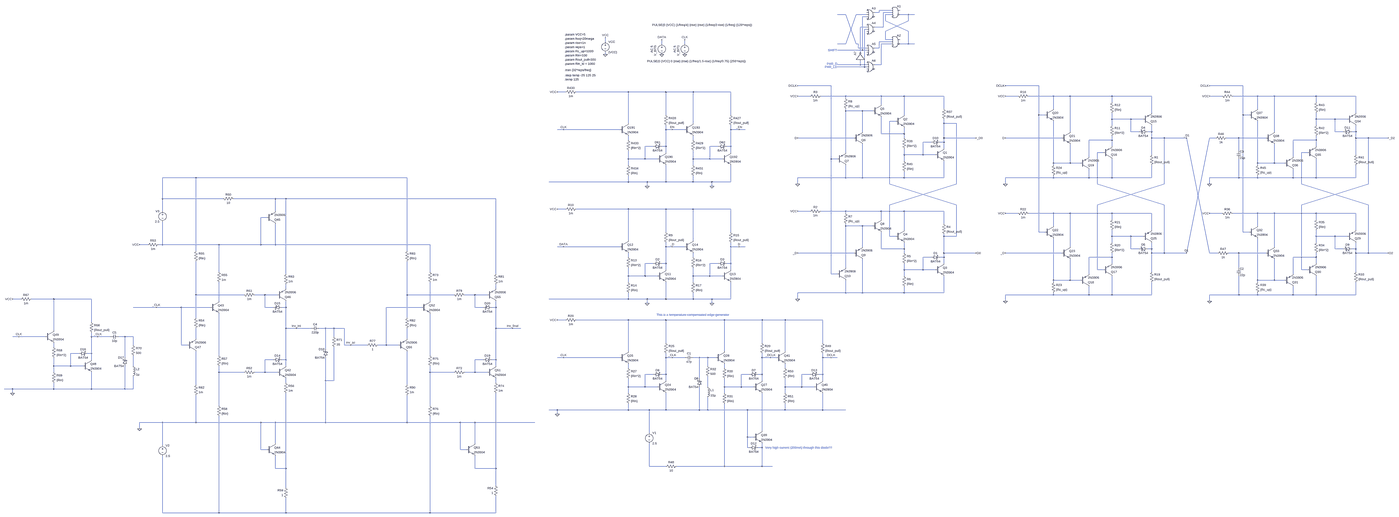
[diagram p0: schematic d_flop.asc, whole sheet]
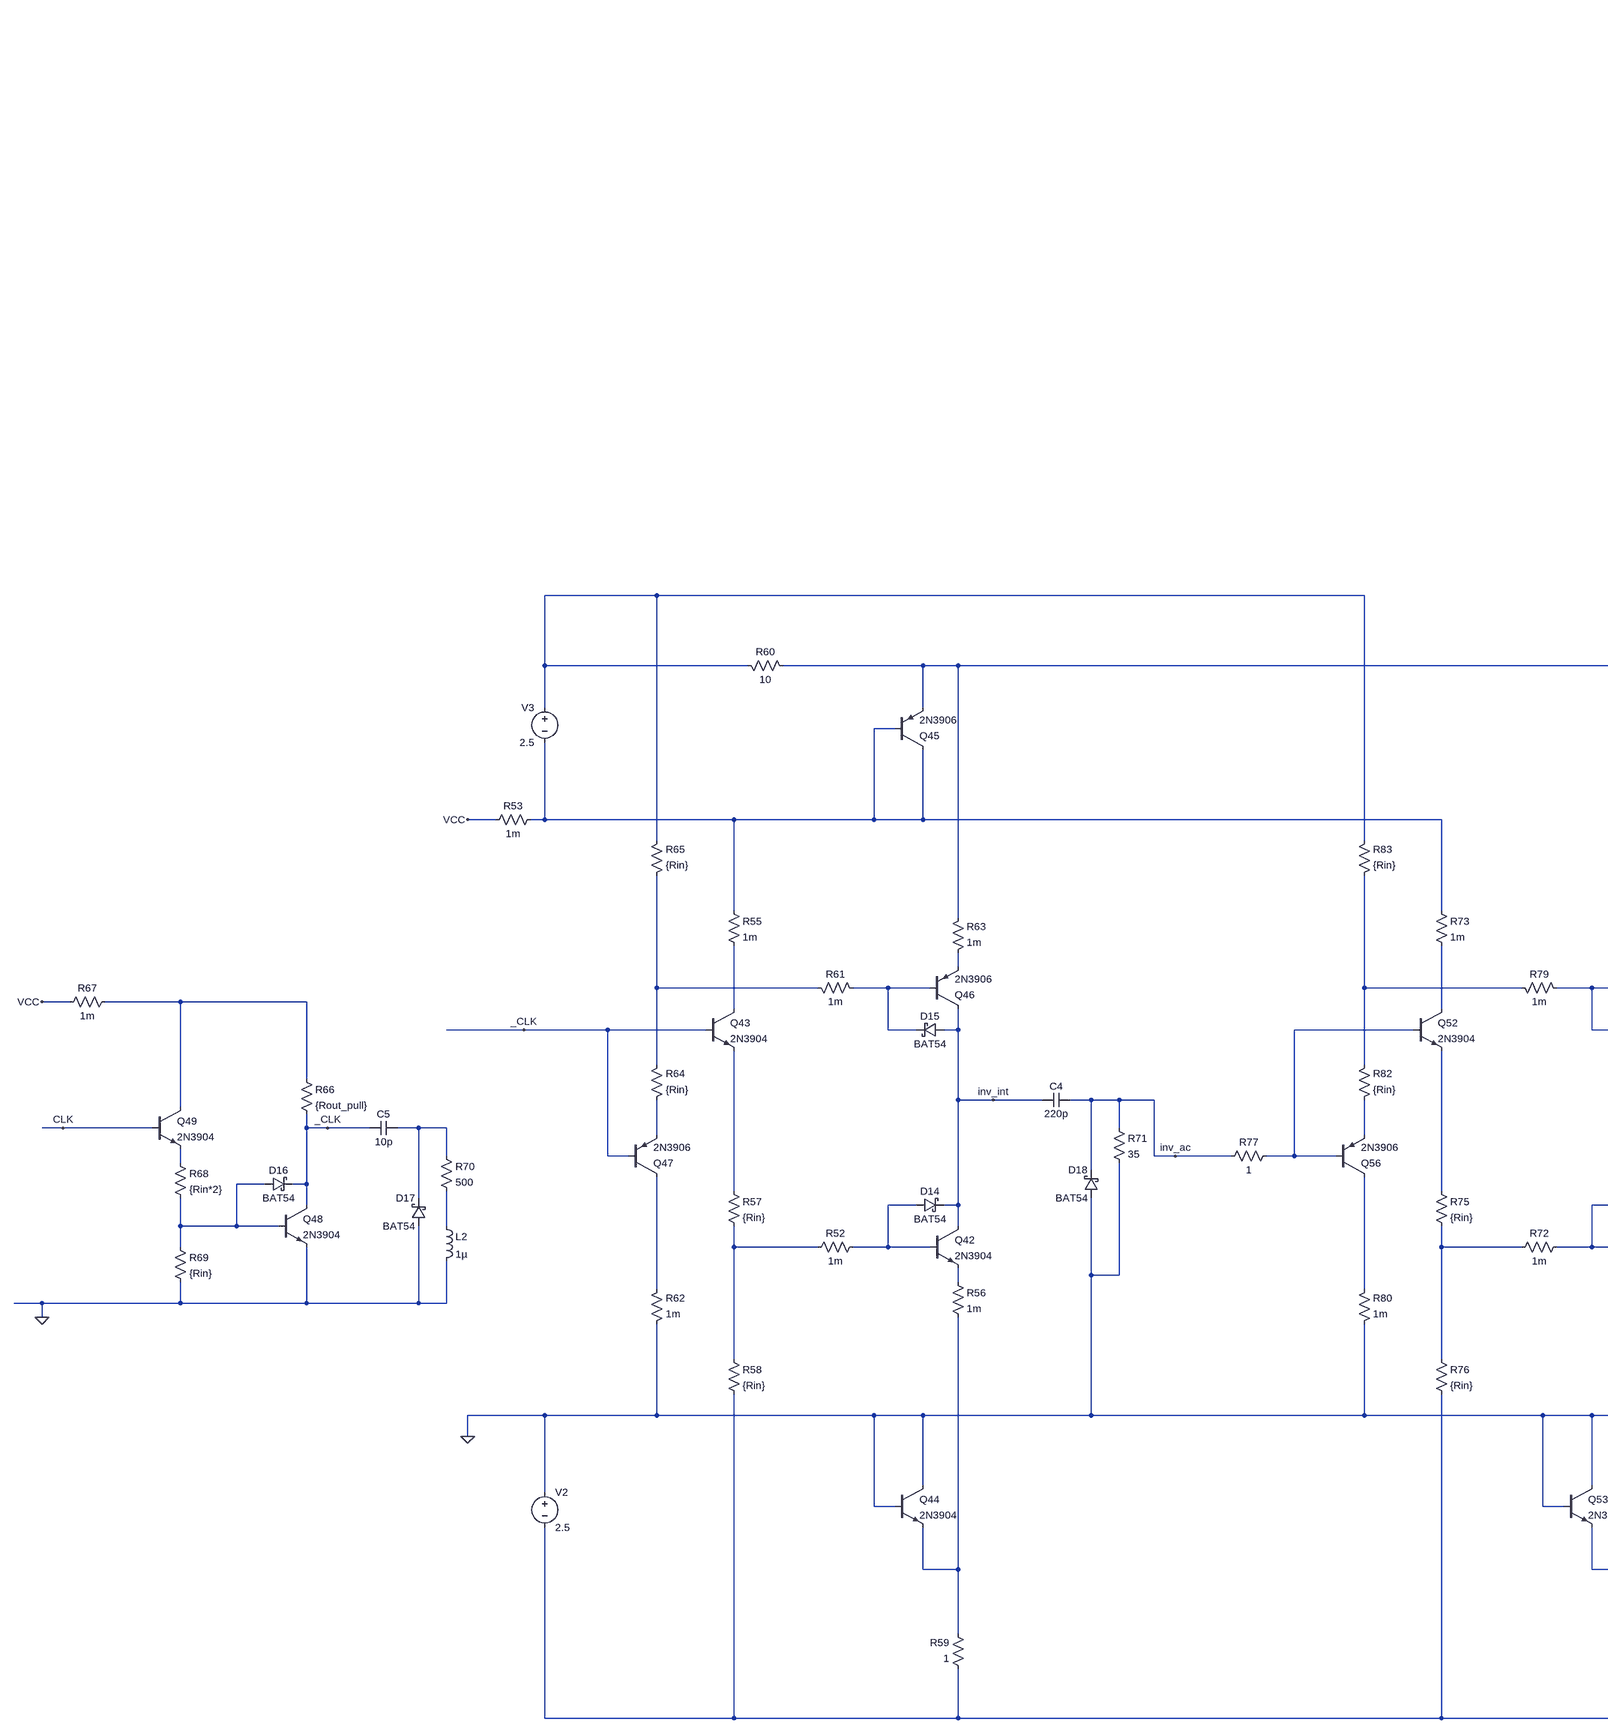
[diagram p1: schematic d_flop.asc, part, row 1 of 1, column 1 of 3]
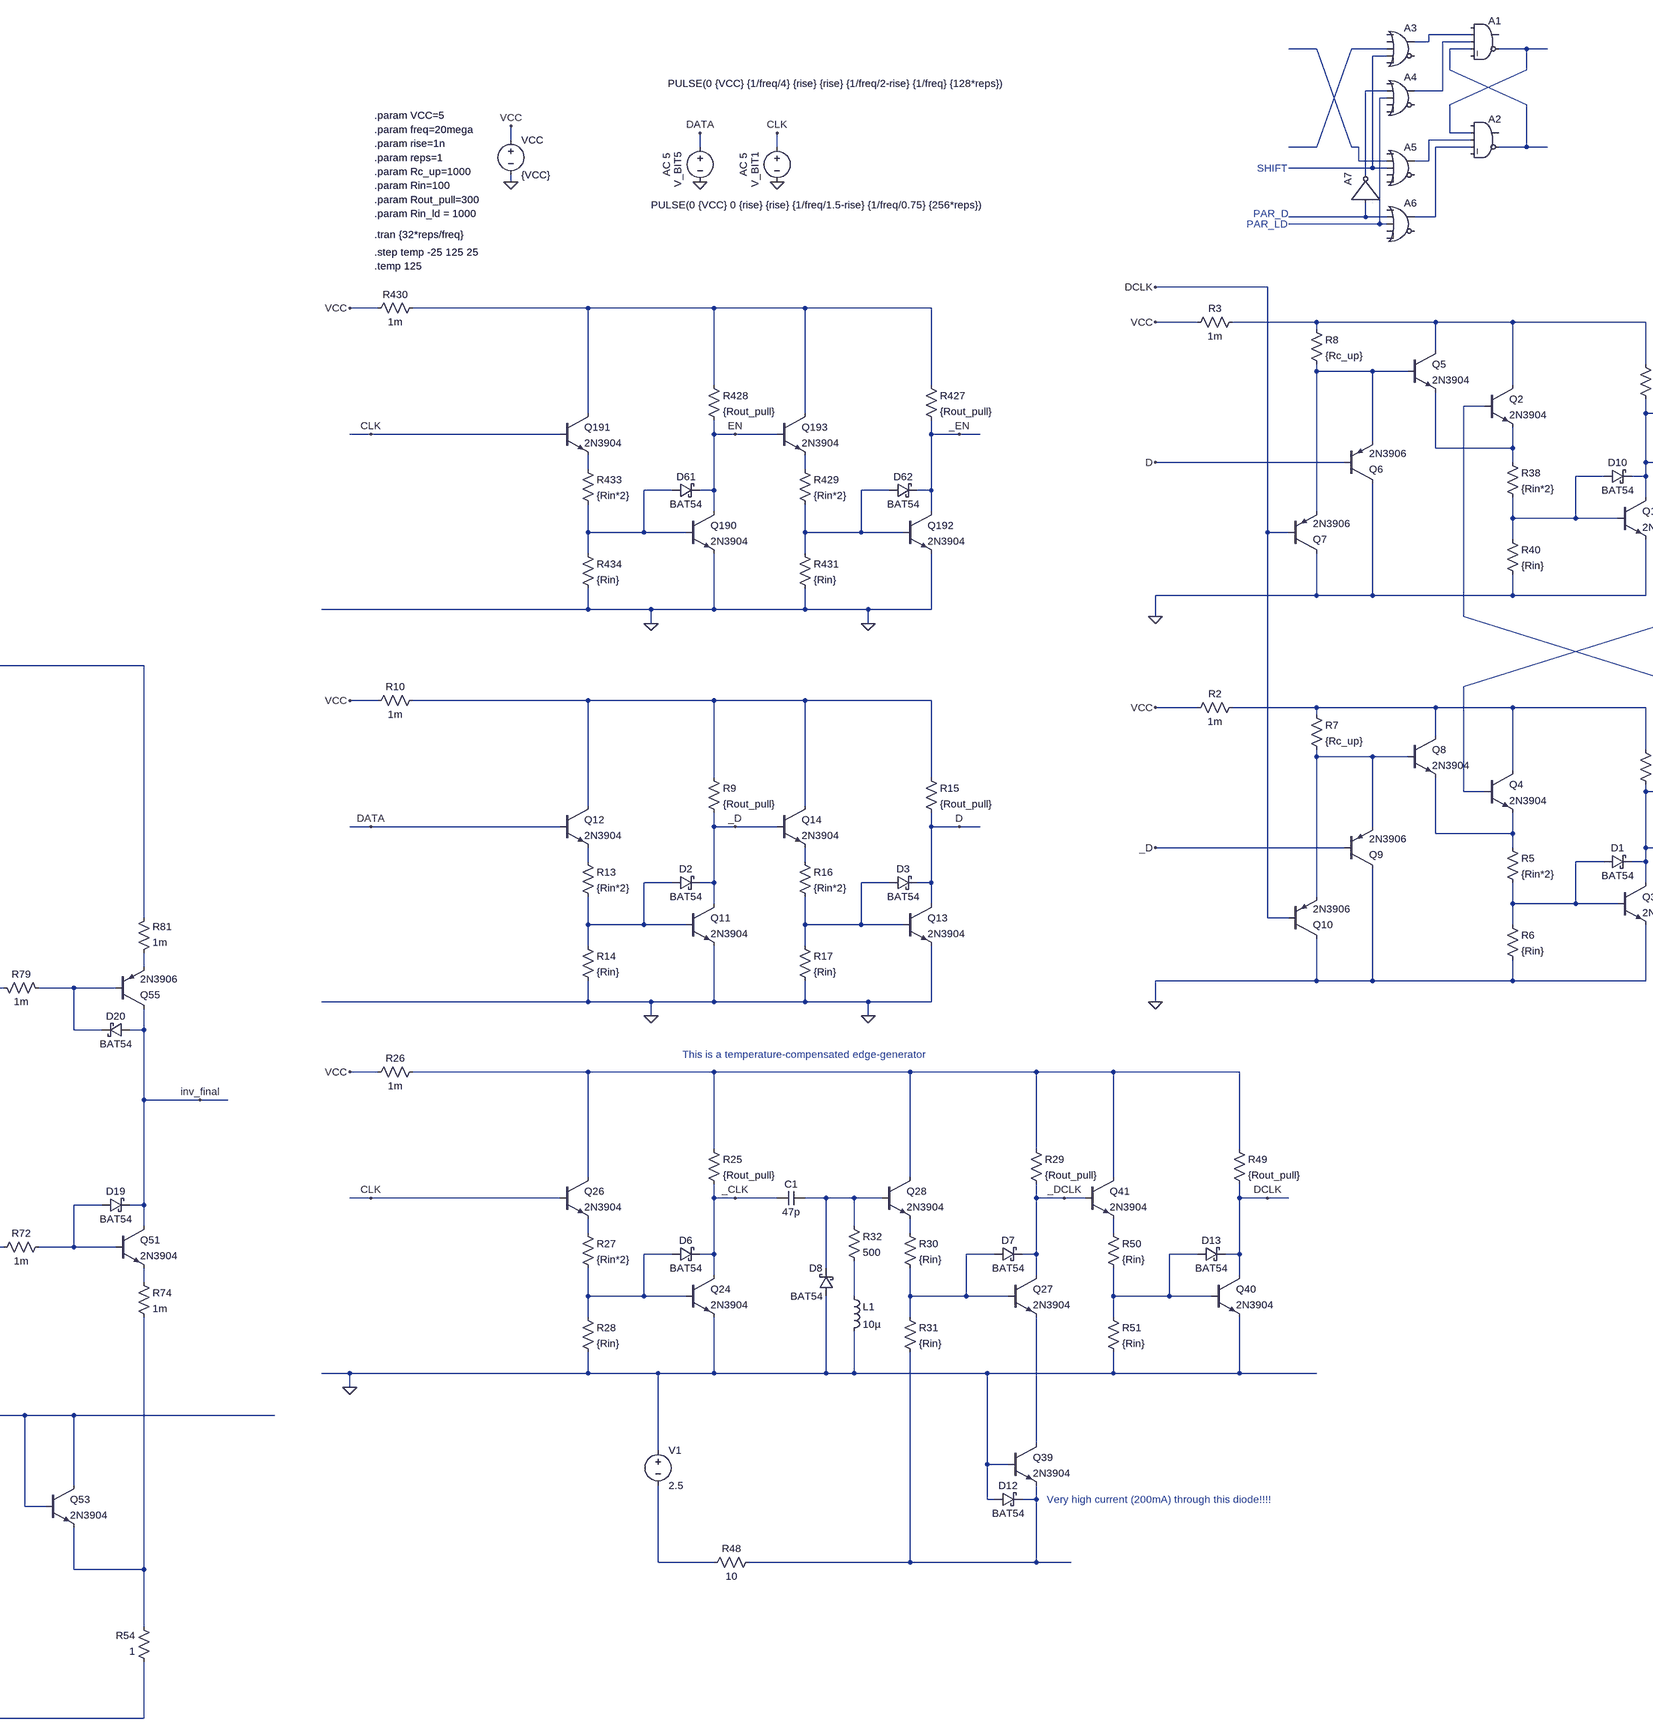
[diagram p2: schematic d_flop.asc, part, row 1 of 1, column 2 of 3]
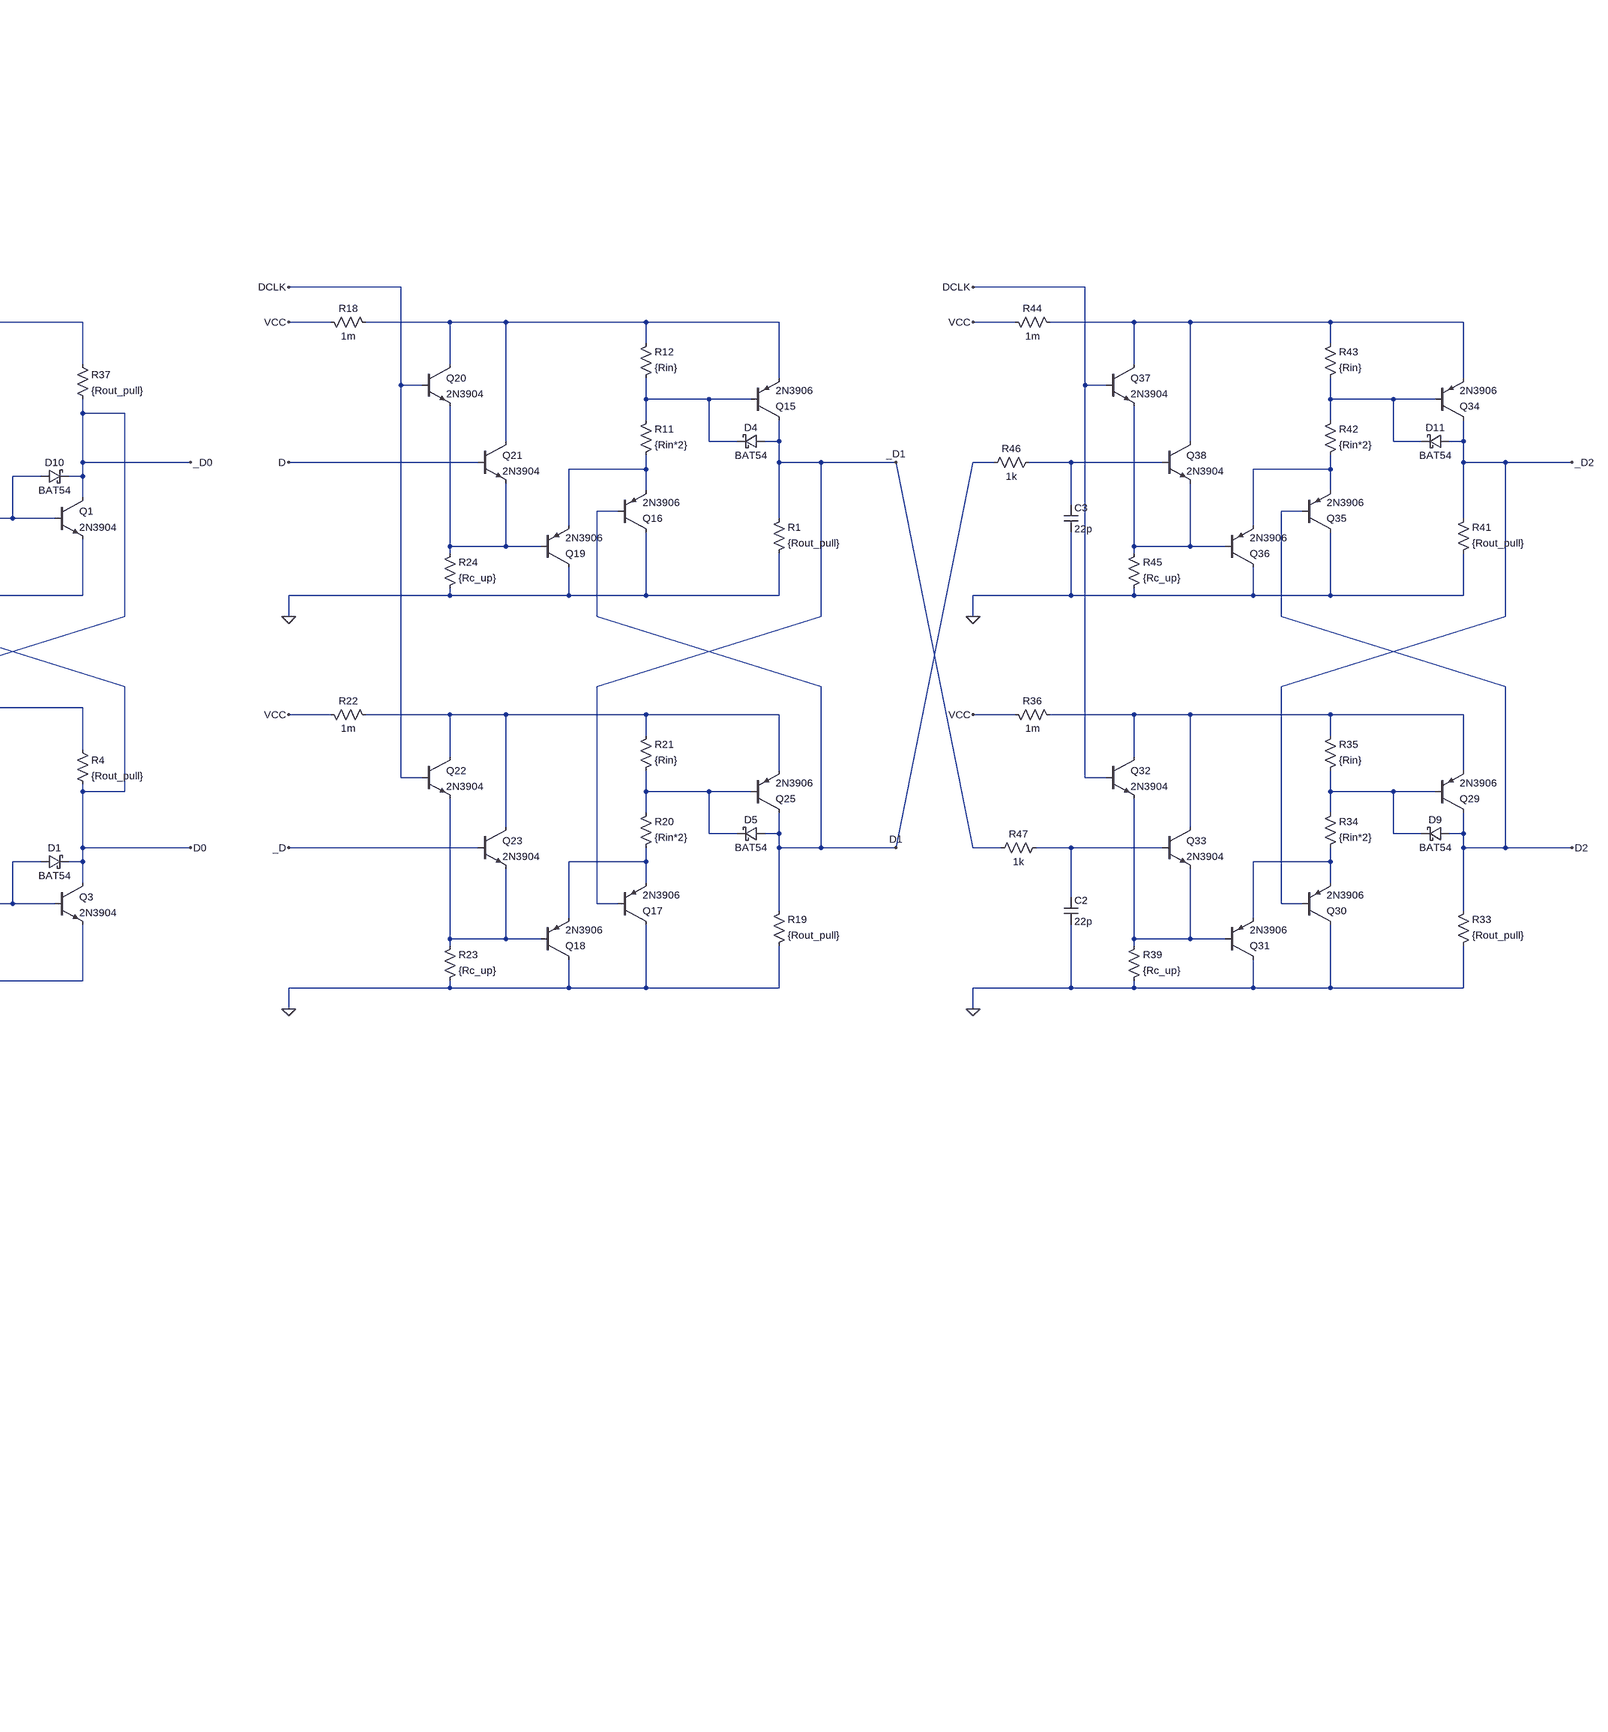
[diagram p3: schematic d_flop.asc, part, row 1 of 1, column 3 of 3]
d_flop.asc, the LTspice schematic file:
Version 4.1
SHEET 1 37460 9492
WIRE 1024 3584 928 3584
WIRE 928 3600 928 3584
WIRE 928 3600 896 3600
WIRE 1024 3600 960 3600
WIRE 672 3616 608 3616
WIRE 832 3616 752 3616
WIRE 1024 3616 976 3616
WIRE 1152 3616 1088 3616
WIRE 1200 3616 1152 3616
WIRE 832 3632 800 3632
WIRE 976 3664 976 3616
WIRE 1152 3664 1152 3616
WIRE 832 3712 784 3712
WIRE 960 3712 960 3600
WIRE 960 3712 896 3712
WIRE 832 3728 816 3728
WIRE 976 3744 1152 3664
WIRE 1152 3744 976 3664
WIRE 976 3808 976 3744
WIRE 1024 3808 976 3808
WIRE -1168 3824 -1168 3792
WIRE 1024 3824 928 3824
WIRE -736 3840 -736 3808
WIRE -560 3840 -560 3808
WIRE 672 3840 752 3616
WIRE 672 3840 608 3840
WIRE 752 3840 672 3616
WIRE 768 3840 752 3840
WIRE 1024 3840 944 3840
WIRE 1152 3840 1152 3744
WIRE 1152 3840 1088 3840
WIRE 1200 3840 1152 3840
WIRE 768 3872 768 3840
WIRE 832 3872 768 3872
WIRE 928 3872 928 3824
WIRE 928 3872 896 3872
WIRE 800 3888 800 3632
WIRE 800 3888 608 3888
WIRE 832 3888 800 3888
WIRE 784 3904 784 3712
WIRE -1168 3920 -1168 3904
WIRE 784 4000 784 3968
WIRE 784 4000 608 4000
WIRE 832 4000 784 4000
WIRE 944 4000 944 3840
WIRE 944 4000 896 4000
WIRE 816 4016 816 3728
WIRE 816 4016 608 4016
WIRE 832 4016 816 4016
WIRE 560 4160 304 4160
WIRE 2272 4160 2016 4160
WIRE 3840 4160 3584 4160
WIRE -1472 4208 -1536 4208
WIRE -992 4208 -1392 4208
WIRE -704 4208 -992 4208
WIRE -496 4208 -704 4208
WIRE -208 4208 -496 4208
WIRE 400 4240 304 4240
WIRE 672 4240 480 4240
WIRE 944 4240 672 4240
WIRE 1120 4240 944 4240
WIRE 1424 4240 1120 4240
WIRE 2112 4240 2016 4240
WIRE 2384 4240 2192 4240
WIRE 2512 4240 2384 4240
WIRE 2832 4240 2512 4240
WIRE 3136 4240 2832 4240
WIRE 3680 4240 3584 4240
WIRE 3952 4240 3760 4240
WIRE 4080 4240 3952 4240
WIRE 4400 4240 4080 4240
WIRE 4704 4240 4400 4240
WIRE 672 4256 672 4240
WIRE 2832 4288 2832 4240
WIRE 4400 4288 4400 4240
WIRE 944 4304 944 4240
WIRE 1424 4336 1424 4240
WIRE 2384 4336 2384 4240
WIRE 3952 4336 3952 4240
WIRE 672 4352 672 4336
WIRE 800 4352 672 4352
WIRE 880 4352 800 4352
WIRE 3136 4368 3136 4240
WIRE 4704 4368 4704 4240
WIRE -704 4384 -704 4208
WIRE -208 4384 -208 4208
WIRE 1120 4384 1120 4240
WIRE 2272 4384 2272 4160
WIRE 2320 4384 2272 4384
WIRE 3840 4384 3840 4160
WIRE 3888 4384 3840 4384
WIRE 2832 4416 2832 4368
WIRE 2976 4416 2832 4416
WIRE 3072 4416 2976 4416
WIRE 4400 4416 4400 4368
WIRE 4544 4416 4400 4416
WIRE 4640 4416 4544 4416
WIRE 1056 4432 1008 4432
WIRE -992 4448 -992 4208
WIRE -496 4448 -496 4208
WIRE 1424 4448 1424 4416
WIRE 1520 4448 1424 4448
WIRE 2832 4464 2832 4416
WIRE 4400 4464 4400 4416
WIRE -1488 4496 -1536 4496
WIRE -1056 4496 -1488 4496
WIRE -704 4496 -704 4464
WIRE -656 4496 -704 4496
WIRE -560 4496 -656 4496
WIRE -208 4496 -208 4464
WIRE -144 4496 -208 4496
WIRE -96 4496 -144 4496
WIRE 800 4512 800 4352
WIRE 2512 4512 2512 4240
WIRE 2976 4512 2976 4416
WIRE 3040 4512 2976 4512
WIRE 3136 4512 3136 4464
WIRE 3136 4512 3104 4512
WIRE 4080 4512 4080 4240
WIRE 4544 4512 4544 4416
WIRE 4608 4512 4544 4512
WIRE 4704 4512 4704 4464
WIRE 4704 4512 4672 4512
WIRE 944 4528 944 4400
WIRE 1120 4528 1120 4480
WIRE 1120 4528 944 4528
WIRE 736 4560 304 4560
WIRE 1120 4560 1120 4528
WIRE 1424 4560 1424 4448
WIRE 1696 4560 1424 4560
WIRE 2448 4560 2016 4560
WIRE 3136 4560 3136 4512
WIRE 3232 4560 3136 4560
WIRE 3408 4560 3232 4560
WIRE 3632 4560 3584 4560
WIRE 3808 4560 3712 4560
WIRE 4016 4560 3808 4560
WIRE 4704 4560 4704 4512
WIRE 4800 4560 4704 4560
WIRE 4976 4560 4800 4560
WIRE -992 4576 -992 4544
WIRE -496 4576 -496 4544
WIRE 2832 4576 2832 4544
WIRE 2832 4576 2656 4576
WIRE 4400 4576 4400 4544
WIRE 4400 4576 4224 4576
WIRE 1328 4592 1264 4592
WIRE 1424 4592 1424 4560
WIRE 1424 4592 1392 4592
WIRE -800 4624 -864 4624
WIRE -704 4624 -704 4496
WIRE -704 4624 -736 4624
WIRE -304 4624 -368 4624
WIRE -208 4624 -208 4496
WIRE -208 4624 -240 4624
WIRE 2832 4624 2832 4576
WIRE 4400 4624 4400 4576
WIRE 1424 4640 1424 4592
WIRE 3808 4656 3808 4560
WIRE -704 4672 -704 4624
WIRE -208 4672 -208 4624
WIRE 672 4672 672 4352
WIRE 2768 4672 2720 4672
WIRE 4336 4672 4288 4672
WIRE 1120 4688 1120 4640
WIRE 1264 4688 1264 4592
WIRE 1264 4688 1120 4688
WIRE 1360 4688 1264 4688
WIRE 3136 4688 3136 4560
WIRE 4704 4688 4704 4560
WIRE 2656 4704 2656 4576
WIRE 4224 4704 4224 4576
WIRE -992 4720 -992 4656
WIRE -864 4720 -864 4624
WIRE -864 4720 -992 4720
WIRE -768 4720 -864 4720
WIRE -496 4720 -496 4656
WIRE -368 4720 -368 4624
WIRE -368 4720 -496 4720
WIRE -272 4720 -368 4720
WIRE 560 4720 560 4160
WIRE 608 4720 560 4720
WIRE 1120 4736 1120 4688
WIRE 2384 4752 2384 4432
WIRE 2512 4752 2512 4608
WIRE 2512 4752 2384 4752
WIRE 2592 4752 2512 4752
WIRE 3952 4752 3952 4432
WIRE 4080 4752 4080 4608
WIRE 4080 4752 3952 4752
WIRE 4160 4752 4080 4752
WIRE -992 4768 -992 4720
WIRE -496 4768 -496 4720
WIRE 2384 4768 2384 4752
WIRE 3952 4768 3952 4752
WIRE -4800 4864 -5056 4864
WIRE -3184 4864 -4800 4864
WIRE 672 4864 672 4768
WIRE 672 4864 304 4864
WIRE 800 4864 800 4608
WIRE 800 4864 672 4864
WIRE 1120 4864 1120 4816
WIRE 1120 4864 800 4864
WIRE 1424 4864 1424 4736
WIRE 1424 4864 1120 4864
WIRE 2384 4864 2384 4848
WIRE 2384 4864 2016 4864
WIRE 2656 4864 2656 4800
WIRE 2656 4864 2384 4864
WIRE 2832 4864 2832 4720
WIRE 2832 4864 2656 4864
WIRE 3136 4864 3136 4768
WIRE 3136 4864 2832 4864
WIRE 3808 4864 3808 4720
WIRE 3808 4864 3584 4864
WIRE 3952 4864 3952 4848
WIRE 3952 4864 3808 4864
WIRE 4224 4864 4224 4800
WIRE 4224 4864 3952 4864
WIRE 4400 4864 4400 4720
WIRE 4400 4864 4224 4864
WIRE 4704 4864 4704 4768
WIRE 4704 4864 4400 4864
WIRE -992 4896 -992 4848
WIRE -992 4896 -1600 4896
WIRE -848 4896 -992 4896
WIRE -704 4896 -704 4768
WIRE -704 4896 -848 4896
WIRE -496 4896 -496 4848
WIRE -496 4896 -704 4896
WIRE -352 4896 -496 4896
WIRE -208 4896 -208 4768
WIRE -208 4896 -352 4896
WIRE 304 4912 304 4864
WIRE 1008 4912 1008 4432
WIRE 1520 4912 1520 4448
WIRE 2016 4912 2016 4864
WIRE 2720 4912 2720 4672
WIRE 3232 4912 3232 4560
WIRE 3584 4912 3584 4864
WIRE 4288 4912 4288 4672
WIRE 4800 4912 4800 4560
WIRE -848 4928 -848 4896
WIRE -352 4928 -352 4896
WIRE -5056 5024 -5056 4864
WIRE -4592 5024 -5056 5024
WIRE -4192 5024 -4512 5024
WIRE -4112 5024 -4192 5024
WIRE -2496 5024 -4112 5024
WIRE 1008 5072 1520 4912
WIRE 1520 5072 1008 4912
WIRE 2720 5072 3232 4912
WIRE 3232 5072 2720 4912
WIRE 4288 5072 4800 4912
WIRE 4800 5072 4288 4912
WIRE -1472 5104 -1536 5104
WIRE -992 5104 -1392 5104
WIRE -704 5104 -992 5104
WIRE -496 5104 -704 5104
WIRE -208 5104 -496 5104
WIRE -5056 5120 -5056 5024
WIRE -4192 5120 -4192 5024
WIRE 400 5120 304 5120
WIRE 672 5120 480 5120
WIRE 944 5120 672 5120
WIRE 1120 5120 944 5120
WIRE 1424 5120 1120 5120
WIRE 672 5136 672 5120
WIRE 2112 5136 2016 5136
WIRE 2384 5136 2192 5136
WIRE 2512 5136 2384 5136
WIRE 2832 5136 2512 5136
WIRE 3136 5136 2832 5136
WIRE 3680 5136 3584 5136
WIRE 3952 5136 3760 5136
WIRE 4080 5136 3952 5136
WIRE 4400 5136 4080 5136
WIRE 4704 5136 4400 5136
WIRE -4256 5168 -4304 5168
WIRE 944 5184 944 5120
WIRE 2832 5184 2832 5136
WIRE 4400 5184 4400 5136
WIRE 1424 5216 1424 5120
WIRE 672 5232 672 5216
WIRE 800 5232 672 5232
WIRE 880 5232 800 5232
WIRE 2384 5232 2384 5136
WIRE 3952 5232 3952 5136
WIRE 1120 5264 1120 5120
WIRE 3136 5264 3136 5136
WIRE 4704 5264 4704 5136
WIRE -704 5280 -704 5104
WIRE -208 5280 -208 5104
WIRE 2272 5280 2272 4384
WIRE 2320 5280 2272 5280
WIRE 3840 5280 3840 4384
WIRE 3888 5280 3840 5280
WIRE 1008 5312 1008 5072
WIRE 1056 5312 1008 5312
WIRE 1424 5312 1424 5296
WIRE 1520 5312 1520 5072
WIRE 1520 5312 1424 5312
WIRE 2832 5312 2832 5264
WIRE 2976 5312 2832 5312
WIRE 3072 5312 2976 5312
WIRE 4400 5312 4400 5264
WIRE 4544 5312 4400 5312
WIRE 4640 5312 4544 5312
WIRE -992 5344 -992 5104
WIRE -496 5344 -496 5104
WIRE 2832 5360 2832 5312
WIRE 4400 5360 4400 5312
WIRE -5168 5376 -5232 5376
WIRE -5056 5376 -5056 5200
WIRE -5056 5376 -5088 5376
WIRE -4624 5376 -5056 5376
WIRE -4304 5376 -4304 5168
WIRE -4304 5376 -4624 5376
WIRE -4192 5376 -4192 5216
WIRE -4192 5376 -4304 5376
WIRE -3008 5376 -4192 5376
WIRE -1488 5392 -1536 5392
WIRE -1056 5392 -1488 5392
WIRE -704 5392 -704 5360
WIRE -656 5392 -704 5392
WIRE -560 5392 -656 5392
WIRE -208 5392 -208 5360
WIRE -144 5392 -208 5392
WIRE -96 5392 -144 5392
WIRE 800 5392 800 5232
WIRE 2512 5392 2512 5136
WIRE 4080 5392 4080 5136
WIRE 944 5408 944 5280
WIRE 1120 5408 1120 5360
WIRE 1120 5408 944 5408
WIRE 2976 5408 2976 5312
WIRE 3040 5408 2976 5408
WIRE 3136 5408 3136 5360
WIRE 3136 5408 3104 5408
WIRE 4544 5408 4544 5312
WIRE 4608 5408 4544 5408
WIRE 4704 5408 4704 5360
WIRE 4704 5408 4672 5408
WIRE -4800 5424 -4800 4864
WIRE -3184 5424 -3184 4864
WIRE 736 5440 304 5440
WIRE 1120 5440 1120 5408
WIRE 1424 5440 1424 5312
WIRE 1696 5440 1424 5440
WIRE 2448 5440 2016 5440
WIRE 3136 5440 3136 5408
WIRE 3232 5440 3232 5072
WIRE 3232 5440 3136 5440
WIRE 3408 5440 3584 4560
WIRE 3408 5440 3232 5440
WIRE 3584 5440 3408 4560
WIRE 3648 5440 3584 5440
WIRE 3808 5440 3728 5440
WIRE 4016 5440 3808 5440
WIRE 4704 5440 4704 5408
WIRE 4800 5440 4800 5072
WIRE 4800 5440 4704 5440
WIRE 4976 5440 4800 5440
WIRE -992 5472 -992 5440
WIRE -496 5472 -496 5440
WIRE 1328 5472 1264 5472
WIRE 1424 5472 1424 5440
WIRE 1424 5472 1392 5472
WIRE 2832 5472 2832 5440
WIRE 2832 5472 2656 5472
WIRE 4400 5472 4400 5440
WIRE 4400 5472 4224 5472
WIRE -800 5520 -864 5520
WIRE -704 5520 -704 5392
WIRE -704 5520 -736 5520
WIRE -304 5520 -368 5520
WIRE -208 5520 -208 5392
WIRE -208 5520 -240 5520
WIRE 1424 5520 1424 5472
WIRE 2832 5520 2832 5472
WIRE 4400 5520 4400 5472
WIRE 672 5552 672 5232
WIRE 3808 5552 3808 5440
WIRE -704 5568 -704 5520
WIRE -208 5568 -208 5520
WIRE 1120 5568 1120 5520
WIRE 1264 5568 1264 5472
WIRE 1264 5568 1120 5568
WIRE 1360 5568 1264 5568
WIRE 2720 5568 2720 5072
WIRE 2768 5568 2720 5568
WIRE 4288 5568 4288 5072
WIRE 4336 5568 4288 5568
WIRE -4624 5584 -4624 5376
WIRE -3008 5584 -3008 5376
WIRE 3136 5584 3136 5440
WIRE 4704 5584 4704 5440
WIRE -4112 5600 -4112 5024
WIRE -2496 5600 -2496 5024
WIRE 560 5600 560 4720
WIRE 608 5600 560 5600
WIRE 2656 5600 2656 5472
WIRE 4224 5600 4224 5472
WIRE -992 5616 -992 5552
WIRE -864 5616 -864 5520
WIRE -864 5616 -992 5616
WIRE -768 5616 -864 5616
WIRE -496 5616 -496 5552
WIRE -368 5616 -368 5520
WIRE -368 5616 -496 5616
WIRE -272 5616 -368 5616
WIRE 1120 5616 1120 5568
WIRE 2384 5648 2384 5328
WIRE 2512 5648 2512 5488
WIRE 2512 5648 2384 5648
WIRE 2592 5648 2512 5648
WIRE 3952 5648 3952 5328
WIRE 4080 5648 4080 5488
WIRE 4080 5648 3952 5648
WIRE 4160 5648 4080 5648
WIRE -992 5664 -992 5616
WIRE -496 5664 -496 5616
WIRE 2384 5664 2384 5648
WIRE 3952 5664 3952 5648
WIRE -4112 5712 -4112 5680
WIRE -2496 5712 -2496 5680
WIRE 672 5744 672 5648
WIRE 672 5744 304 5744
WIRE 800 5744 800 5488
WIRE 800 5744 672 5744
WIRE 1120 5744 1120 5696
WIRE 1120 5744 800 5744
WIRE 1424 5744 1424 5616
WIRE 1424 5744 1120 5744
WIRE -4800 5760 -4800 5504
WIRE -4432 5760 -4800 5760
WIRE -4272 5760 -4352 5760
WIRE -4176 5760 -4272 5760
WIRE -3184 5760 -3184 5504
WIRE -2816 5760 -3184 5760
WIRE -2656 5760 -2736 5760
WIRE -2560 5760 -2656 5760
WIRE 2384 5760 2384 5744
WIRE 2384 5760 2016 5760
WIRE 2656 5760 2656 5696
WIRE 2656 5760 2384 5760
WIRE 2832 5760 2832 5616
WIRE 2832 5760 2656 5760
WIRE 3136 5760 3136 5664
WIRE 3136 5760 2832 5760
WIRE 3808 5760 3808 5616
WIRE 3808 5760 3584 5760
WIRE 3952 5760 3952 5744
WIRE 3952 5760 3808 5760
WIRE 4224 5760 4224 5696
WIRE 4224 5760 3952 5760
WIRE 4400 5760 4400 5616
WIRE 4400 5760 4224 5760
WIRE 4704 5760 4704 5664
WIRE 4704 5760 4400 5760
WIRE -6368 5792 -6432 5792
WIRE -5888 5792 -6288 5792
WIRE -5600 5792 -5888 5792
WIRE -992 5792 -992 5744
WIRE -992 5792 -1600 5792
WIRE -848 5792 -992 5792
WIRE -704 5792 -704 5664
WIRE -704 5792 -848 5792
WIRE -496 5792 -496 5744
WIRE -496 5792 -704 5792
WIRE -352 5792 -496 5792
WIRE -208 5792 -208 5664
WIRE -208 5792 -352 5792
WIRE 304 5792 304 5744
WIRE -4624 5808 -4624 5664
WIRE -3008 5808 -3008 5664
WIRE 2016 5808 2016 5760
WIRE 3584 5808 3584 5760
WIRE -848 5824 -848 5792
WIRE -352 5824 -352 5792
WIRE -5104 5856 -5280 5856
WIRE -4912 5856 -5104 5856
WIRE -4688 5856 -4912 5856
WIRE -4272 5856 -4272 5760
WIRE -4208 5856 -4272 5856
WIRE -4112 5856 -4112 5808
WIRE -4112 5856 -4144 5856
WIRE -3072 5856 -3344 5856
WIRE -2656 5856 -2656 5760
WIRE -2592 5856 -2656 5856
WIRE -2496 5856 -2496 5808
WIRE -2496 5856 -2528 5856
WIRE -4800 5936 -4800 5760
WIRE -3184 5936 -3184 5760
WIRE -1472 5952 -1536 5952
WIRE -992 5952 -1392 5952
WIRE -704 5952 -992 5952
WIRE -256 5952 -704 5952
WIRE 32 5952 -256 5952
WIRE 208 5952 32 5952
WIRE 496 5952 208 5952
WIRE -5600 5968 -5600 5792
WIRE -4112 6016 -4112 5856
WIRE -4032 6016 -4112 6016
WIRE -3920 6016 -4032 6016
WIRE -3808 6016 -3856 6016
WIRE -3744 6016 -3808 6016
WIRE -3664 6016 -3744 6016
WIRE -2496 6016 -2496 5856
WIRE -2368 6016 -2496 6016
WIRE -2304 6016 -2368 6016
WIRE -5888 6032 -5888 5792
WIRE -6384 6080 -6432 6080
WIRE -5952 6080 -6384 6080
WIRE -5600 6080 -5600 6048
WIRE -5552 6080 -5600 6080
WIRE -5456 6080 -5552 6080
WIRE -5344 6080 -5392 6080
WIRE -5280 6080 -5344 6080
WIRE -3744 6080 -3744 6016
WIRE -4800 6096 -4800 6016
WIRE -3184 6096 -3184 6016
WIRE -704 6128 -704 5952
WIRE 32 6128 32 5952
WIRE 496 6128 496 5952
WIRE -5280 6144 -5280 6080
WIRE -4912 6144 -4912 5856
WIRE -4864 6144 -4912 6144
WIRE -3664 6144 -3664 6016
WIRE -3616 6144 -3664 6144
WIRE -3488 6144 -3616 6144
WIRE -3344 6144 -3344 5856
WIRE -3344 6144 -3408 6144
WIRE -3248 6144 -3344 6144
WIRE -5888 6160 -5888 6128
WIRE -3808 6176 -3808 6016
WIRE -992 6192 -992 5952
WIRE -256 6192 -256 5952
WIRE 208 6192 208 5952
WIRE -5696 6208 -5760 6208
WIRE -5600 6208 -5600 6080
WIRE -5600 6208 -5632 6208
WIRE -4624 6224 -4624 5904
WIRE -3008 6224 -3008 5904
WIRE -5344 6240 -5344 6080
WIRE -1488 6240 -1536 6240
WIRE -1056 6240 -1488 6240
WIRE -704 6240 -704 6208
WIRE -656 6240 -704 6240
WIRE -560 6240 -656 6240
WIRE -448 6240 -496 6240
WIRE -384 6240 -448 6240
WIRE -320 6240 -384 6240
WIRE 32 6240 32 6208
WIRE 96 6240 32 6240
WIRE 144 6240 96 6240
WIRE 496 6240 496 6208
WIRE 560 6240 496 6240
WIRE 608 6240 560 6240
WIRE -5600 6256 -5600 6208
WIRE -4208 6256 -4272 6256
WIRE -4112 6256 -4112 6016
WIRE -4112 6256 -4144 6256
WIRE -2592 6256 -2656 6256
WIRE -2496 6256 -2496 6016
WIRE -2496 6256 -2528 6256
WIRE -5888 6304 -5888 6240
WIRE -5760 6304 -5760 6208
WIRE -5760 6304 -5888 6304
WIRE -5664 6304 -5760 6304
WIRE -5280 6304 -5280 6224
WIRE -4112 6304 -4112 6256
WIRE -2496 6304 -2496 6256
WIRE -384 6304 -384 6240
WIRE -992 6320 -992 6288
WIRE -256 6320 -256 6288
WIRE 208 6320 208 6288
WIRE -5888 6352 -5888 6304
WIRE -4624 6352 -4624 6304
WIRE -4432 6352 -4624 6352
WIRE -4272 6352 -4272 6256
WIRE -4272 6352 -4352 6352
WIRE -4176 6352 -4272 6352
WIRE -3008 6352 -3008 6304
WIRE -2816 6352 -3008 6352
WIRE -2656 6352 -2656 6256
WIRE -2656 6352 -2736 6352
WIRE -2560 6352 -2656 6352
WIRE -800 6368 -864 6368
WIRE -704 6368 -704 6240
WIRE -704 6368 -736 6368
WIRE -64 6368 -128 6368
WIRE 32 6368 32 6240
WIRE 32 6368 0 6368
WIRE 400 6368 336 6368
WIRE 496 6368 496 6240
WIRE 496 6368 464 6368
WIRE -448 6400 -448 6240
WIRE -3808 6416 -3808 6240
WIRE -3744 6416 -3744 6160
WIRE -3744 6416 -3808 6416
WIRE -704 6416 -704 6368
WIRE 32 6416 32 6368
WIRE 496 6416 496 6368
WIRE -4112 6432 -4112 6400
WIRE -2496 6432 -2496 6400
WIRE -4800 6448 -4800 6192
WIRE -3184 6448 -3184 6192
WIRE -992 6464 -992 6400
WIRE -864 6464 -864 6368
WIRE -864 6464 -992 6464
WIRE -768 6464 -864 6464
WIRE -384 6464 -384 6384
WIRE -256 6464 -256 6400
WIRE -128 6464 -128 6368
WIRE -128 6464 -256 6464
WIRE -32 6464 -128 6464
WIRE 208 6464 208 6400
WIRE 336 6464 336 6368
WIRE 336 6464 208 6464
WIRE 432 6464 336 6464
WIRE -6432 6480 -6496 6480
WIRE -5888 6480 -5888 6432
WIRE -5888 6480 -6432 6480
WIRE -5600 6480 -5600 6352
WIRE -5600 6480 -5888 6480
WIRE -5344 6480 -5344 6304
WIRE -5344 6480 -5600 6480
WIRE -5280 6480 -5280 6384
WIRE -5280 6480 -5344 6480
WIRE -6432 6512 -6432 6480
WIRE -992 6512 -992 6464
WIRE -256 6512 -256 6464
WIRE 208 6512 208 6464
WIRE -4624 6608 -4624 6352
WIRE -3008 6608 -3008 6352
WIRE -1536 6640 -1600 6640
WIRE -992 6640 -992 6592
WIRE -992 6640 -1536 6640
WIRE -832 6640 -992 6640
WIRE -704 6640 -704 6512
WIRE -704 6640 -832 6640
WIRE -448 6640 -448 6464
WIRE -448 6640 -704 6640
WIRE -384 6640 -384 6544
WIRE -384 6640 -448 6640
WIRE -80 6640 -384 6640
WIRE 208 6640 208 6592
WIRE 208 6640 -80 6640
WIRE 496 6640 496 6512
WIRE 496 6640 208 6640
WIRE 672 6640 496 6640
WIRE -1536 6672 -1536 6640
WIRE -5056 6736 -5232 6736
WIRE -4800 6736 -4800 6528
WIRE -4800 6736 -5056 6736
WIRE -4304 6736 -4800 6736
WIRE -4192 6736 -4304 6736
WIRE -3808 6736 -3808 6416
WIRE -3808 6736 -4192 6736
WIRE -3184 6736 -3184 6528
WIRE -3184 6736 -3808 6736
WIRE -2768 6736 -3184 6736
WIRE -2656 6736 -2768 6736
WIRE -2192 6736 -2656 6736
WIRE -5232 6784 -5232 6736
WIRE 32 6800 32 6512
WIRE -832 6816 -832 6640
WIRE -80 6848 -80 6640
WIRE -32 6848 -80 6848
WIRE -4192 6896 -4192 6736
WIRE -2656 6896 -2656 6736
WIRE -5056 6912 -5056 6736
WIRE -80 6928 -80 6848
WIRE -64 6928 -80 6928
WIRE 32 6928 32 6896
WIRE 32 6928 0 6928
WIRE -4304 6944 -4304 6736
WIRE -4256 6944 -4304 6944
WIRE -2768 6944 -2768 6736
WIRE -2720 6944 -2768 6944
WIRE -832 7072 -832 6896
WIRE -704 7072 -832 7072
WIRE -256 7072 -256 6592
WIRE -256 7072 -624 7072
WIRE 32 7072 32 6928
WIRE 32 7072 -256 7072
WIRE 112 7072 32 7072
WIRE -4192 7088 -4192 6992
WIRE -4112 7088 -4112 6512
WIRE -4112 7088 -4192 7088
WIRE -2656 7088 -2656 6992
WIRE -2496 7088 -2496 6512
WIRE -2496 7088 -2656 7088
WIRE -2496 7248 -2496 7088
WIRE -4112 7264 -4112 7088
WIRE -5056 7520 -5056 6992
WIRE -4624 7520 -4624 6688
WIRE -4624 7520 -5056 7520
WIRE -4112 7520 -4112 7344
WIRE -4112 7520 -4624 7520
WIRE -3008 7520 -3008 6688
WIRE -3008 7520 -4112 7520
WIRE -2496 7520 -2496 7328
WIRE -2496 7520 -3008 7520
FLAG -1168 3920 0
FLAG -1168 3792 VCC
FLAG -736 3920 0
FLAG -736 3808 DATA
FLAG -848 4928 0
FLAG -1536 4208 VCC
FLAG -352 4928 0
FLAG -1488 4496 CLK
FLAG -656 4496 EN
FLAG 304 4912 0
FLAG 304 4240 VCC
FLAG 304 5792 0
FLAG 304 5120 VCC
FLAG 304 5440 _D
FLAG 304 4560 D
FLAG 304 4160 DCLK
FLAG -848 5824 0
FLAG -1536 5104 VCC
FLAG -352 5824 0
FLAG -1488 5392 DATA
FLAG -656 5392 _D
FLAG -144 5392 D
FLAG -560 3920 0
FLAG -560 3808 CLK
FLAG -144 4496 _EN
FLAG 1696 5440 D0
FLAG 1696 4560 _D0
FLAG 2016 5808 0
FLAG 2016 5136 VCC
FLAG 2016 5440 _D
FLAG 2016 4160 DCLK
FLAG 3408 5440 D1
FLAG 2016 4912 0
FLAG 2016 4240 VCC
FLAG 2016 4560 D
FLAG 3408 4560 _D1
FLAG -1536 5952 VCC
FLAG -1536 6672 0
FLAG -1488 6240 CLK
FLAG -656 6240 _CLK
FLAG 96 6240 _DCLK
FLAG 3584 5808 0
FLAG 3584 5136 VCC
FLAG 3584 4160 DCLK
FLAG 4976 5440 D2
FLAG 3584 4912 0
FLAG 3584 4240 VCC
FLAG 4976 4560 _D2
FLAG 560 6240 DCLK
FLAG -5232 6784 0
FLAG -5232 5376 VCC
FLAG -6432 5792 VCC
FLAG -6432 6512 0
FLAG -6384 6080 CLK
FLAG -5552 6080 _CLK
FLAG -5104 5856 _CLK
FLAG -4032 6016 inv_int
FLAG -2368 6016 inv_final
FLAG -3616 6144 inv_ac
SYMBOL voltage -1168 3808 R0
WINDOW 123 0 0 Left 0
WINDOW 39 0 0 Left 0
SYMATTR InstName VCC
SYMATTR Value {VCC}
SYMBOL voltage -736 3824 R0
WINDOW 123 -77 30 VRight 2
WINDOW 39 0 0 Left 0
WINDOW 0 -51 28 VRight 2
WINDOW 3 647 148 Right 2
SYMATTR Value2 AC 5
SYMATTR InstName V_BIT5
SYMATTR Value PULSE(0 {VCC} 0 {rise} {rise} {1/freq/1.5-rise} {1/freq/0.75} {256*reps})
SYMBOL Digital\\and 1056 3536 R0
SYMATTR InstName A1
SYMBOL Digital\\and 1056 3760 R0
SYMATTR InstName A2
SYMBOL Digital\\or 864 3552 R0
SYMATTR InstName A3
SYMBOL Digital\\or 864 3664 R0
SYMATTR InstName A4
SYMBOL Digital\\or 864 3824 R0
SYMATTR InstName A5
SYMBOL Digital\\or 864 3952 R0
SYMATTR InstName A6
SYMBOL Digital\\inv 720 3968 R270
SYMATTR InstName A7
SYMBOL npn -768 4672 R0
SYMATTR InstName Q190
SYMATTR Value 2N3904
SYMBOL schottky -800 4640 R270
WINDOW 0 32 32 VTop 2
WINDOW 3 0 32 VBottom 2
SYMATTR InstName D61
SYMATTR Value BAT54
SYMATTR Description Diode
SYMATTR Type diode
SYMBOL res -720 4368 R0
SYMATTR InstName R428
SYMATTR Value {Rout_pull}
SYMBOL res -1488 4224 R270
WINDOW 0 32 56 VTop 2
WINDOW 3 0 56 VBottom 2
SYMATTR InstName R430
SYMATTR Value 1m
SYMBOL npn -1056 4448 R0
SYMATTR InstName Q191
SYMATTR Value 2N3904
SYMBOL res -1008 4560 R0
SYMATTR InstName R433
SYMATTR Value {Rin*2}
SYMBOL res -1008 4752 R0
SYMATTR InstName R434
SYMATTR Value {Rin}
SYMBOL npn -272 4672 R0
SYMATTR InstName Q192
SYMATTR Value 2N3904
SYMBOL schottky -304 4640 R270
WINDOW 0 32 32 VTop 2
WINDOW 3 0 32 VBottom 2
SYMATTR InstName D62
SYMATTR Value BAT54
SYMATTR Description Diode
SYMATTR Type diode
SYMBOL res -224 4368 R0
SYMATTR InstName R427
SYMATTR Value {Rout_pull}
SYMBOL npn -560 4448 R0
SYMATTR InstName Q193
SYMATTR Value 2N3904
SYMBOL res -512 4560 R0
SYMATTR InstName R429
SYMATTR Value {Rin*2}
SYMBOL res -512 4752 R0
SYMATTR InstName R431
SYMATTR Value {Rin}
SYMBOL npn 1360 4640 R0
SYMATTR InstName Q1
SYMATTR Value 2N3904
SYMBOL schottky 1328 4608 R270
WINDOW 0 32 32 VTop 2
WINDOW 3 0 32 VBottom 2
SYMATTR InstName D10
SYMATTR Value BAT54
SYMATTR Description Diode
SYMATTR Type diode
SYMBOL res 384 4256 R270
WINDOW 0 32 56 VTop 2
WINDOW 3 0 56 VBottom 2
SYMATTR InstName R3
SYMATTR Value 1m
SYMBOL npn 1056 4384 R0
SYMATTR InstName Q2
SYMATTR Value 2N3904
SYMBOL res 1408 4320 R0
SYMATTR InstName R37
SYMATTR Value {Rout_pull}
SYMBOL res 1104 4544 R0
SYMATTR InstName R38
SYMATTR Value {Rin*2}
SYMBOL res 1104 4720 R0
SYMATTR InstName R40
SYMATTR Value {Rin}
SYMBOL npn 1360 5520 R0
SYMATTR InstName Q3
SYMATTR Value 2N3904
SYMBOL schottky 1328 5488 R270
WINDOW 0 32 32 VTop 2
WINDOW 3 0 32 VBottom 2
SYMATTR InstName D1
SYMATTR Value BAT54
SYMATTR Description Diode
SYMATTR Type diode
SYMBOL npn 1056 5264 R0
SYMATTR InstName Q4
SYMATTR Value 2N3904
SYMBOL res 1408 5200 R0
SYMATTR InstName R4
SYMATTR Value {Rout_pull}
SYMBOL res 1104 5424 R0
SYMATTR InstName R5
SYMATTR Value {Rin*2}
SYMBOL res 1104 5600 R0
SYMATTR InstName R6
SYMATTR Value {Rin}
SYMBOL npn 880 4304 R0
SYMATTR InstName Q5
SYMATTR Value 2N3904
SYMBOL pnp 736 4608 M180
SYMATTR InstName Q6
SYMATTR Value 2N3906
SYMBOL pnp 608 4768 M180
SYMATTR InstName Q7
SYMATTR Value 2N3906
SYMBOL res 384 5136 R270
WINDOW 0 32 56 VTop 2
WINDOW 3 0 56 VBottom 2
SYMATTR InstName R2
SYMATTR Value 1m
SYMBOL npn 880 5184 R0
SYMATTR InstName Q8
SYMATTR Value 2N3904
SYMBOL pnp 736 5488 M180
SYMATTR InstName Q9
SYMATTR Value 2N3906
SYMBOL pnp 608 5648 M180
SYMATTR InstName Q10
SYMATTR Value 2N3906
SYMBOL res 656 5120 R0
SYMATTR InstName R7
SYMATTR Value {Rc_up}
SYMBOL res 656 4240 R0
SYMATTR InstName R8
SYMATTR Value {Rc_up}
SYMBOL npn -768 5568 R0
SYMATTR InstName Q11
SYMATTR Value 2N3904
SYMBOL schottky -800 5536 R270
WINDOW 0 32 32 VTop 2
WINDOW 3 0 32 VBottom 2
SYMATTR InstName D2
SYMATTR Value BAT54
SYMATTR Description Diode
SYMATTR Type diode
SYMBOL res -720 5264 R0
SYMATTR InstName R9
SYMATTR Value {Rout_pull}
SYMBOL res -1488 5120 R270
WINDOW 0 32 56 VTop 2
WINDOW 3 0 56 VBottom 2
SYMATTR InstName R10
SYMATTR Value 1m
SYMBOL npn -1056 5344 R0
SYMATTR InstName Q12
SYMATTR Value 2N3904
SYMBOL res -1008 5456 R0
SYMATTR InstName R13
SYMATTR Value {Rin*2}
SYMBOL res -1008 5648 R0
SYMATTR InstName R14
SYMATTR Value {Rin}
SYMBOL npn -272 5568 R0
SYMATTR InstName Q13
SYMATTR Value 2N3904
SYMBOL schottky -304 5536 R270
WINDOW 0 32 32 VTop 2
WINDOW 3 0 32 VBottom 2
SYMATTR InstName D3
SYMATTR Value BAT54
SYMATTR Description Diode
SYMATTR Type diode
SYMBOL res -224 5264 R0
SYMATTR InstName R15
SYMATTR Value {Rout_pull}
SYMBOL npn -560 5344 R0
SYMATTR InstName Q14
SYMATTR Value 2N3904
SYMBOL res -512 5456 R0
SYMATTR InstName R16
SYMATTR Value {Rin*2}
SYMBOL res -512 5648 R0
SYMATTR InstName R17
SYMATTR Value {Rin}
SYMBOL voltage -560 3824 R0
WINDOW 123 -77 30 VRight 2
WINDOW 39 0 0 Left 0
WINDOW 0 -51 28 VRight 2
WINDOW 3 521 -129 Right 2
SYMATTR Value2 AC 5
SYMATTR InstName V_BIT1
SYMATTR Value PULSE(0 {VCC} {1/freq/4} {rise} {rise} {1/freq/2-rise} {1/freq} {128*reps})
SYMBOL schottky 3104 5424 M270
WINDOW 0 32 32 VTop 2
WINDOW 3 0 32 VBottom 2
SYMATTR InstName D5
SYMATTR Value BAT54
SYMATTR Description Diode
SYMATTR Type diode
SYMBOL res 3120 5680 M180
WINDOW 0 36 76 Left 2
WINDOW 3 36 40 Left 2
SYMATTR InstName R19
SYMATTR Value {Rout_pull}
SYMBOL res 2816 5456 M180
WINDOW 0 36 76 Left 2
WINDOW 3 36 40 Left 2
SYMATTR InstName R20
SYMATTR Value {Rin*2}
SYMBOL res 2816 5280 M180
WINDOW 0 36 76 Left 2
WINDOW 3 36 40 Left 2
SYMATTR InstName R21
SYMATTR Value {Rin}
SYMBOL res 2096 5120 M90
WINDOW 0 0 56 VBottom 2
WINDOW 3 32 56 VTop 2
SYMATTR InstName R22
SYMATTR Value 1m
SYMBOL res 2368 5760 M180
WINDOW 0 36 76 Left 2
WINDOW 3 36 40 Left 2
SYMATTR InstName R23
SYMATTR Value {Rc_up}
SYMBOL pnp 3072 5360 M180
SYMATTR InstName Q25
SYMATTR Value 2N3906
SYMBOL pnp 2768 5616 M180
SYMATTR InstName Q17
SYMATTR Value 2N3906
SYMBOL pnp 2592 5696 M180
SYMATTR InstName Q18
SYMATTR Value 2N3906
SYMBOL npn 2320 5232 R0
SYMATTR InstName Q22
SYMATTR Value 2N3904
SYMBOL npn 2448 5392 R0
SYMATTR InstName Q23
SYMATTR Value 2N3904
SYMBOL schottky 3104 4528 M270
WINDOW 0 32 32 VTop 2
WINDOW 3 0 32 VBottom 2
SYMATTR InstName D4
SYMATTR Value BAT54
SYMATTR Description Diode
SYMATTR Type diode
SYMBOL res 3120 4784 M180
WINDOW 0 36 76 Left 2
WINDOW 3 36 40 Left 2
SYMATTR InstName R1
SYMATTR Value {Rout_pull}
SYMBOL res 2816 4560 M180
WINDOW 0 36 76 Left 2
WINDOW 3 36 40 Left 2
SYMATTR InstName R11
SYMATTR Value {Rin*2}
SYMBOL res 2816 4384 M180
WINDOW 0 36 76 Left 2
WINDOW 3 36 40 Left 2
SYMATTR InstName R12
SYMATTR Value {Rin}
SYMBOL res 2096 4224 M90
WINDOW 0 0 56 VBottom 2
WINDOW 3 32 56 VTop 2
SYMATTR InstName R18
SYMATTR Value 1m
SYMBOL res 2368 4864 M180
WINDOW 0 36 76 Left 2
WINDOW 3 36 40 Left 2
SYMATTR InstName R24
SYMATTR Value {Rc_up}
SYMBOL pnp 3072 4464 M180
SYMATTR InstName Q15
SYMATTR Value 2N3906
SYMBOL pnp 2768 4720 M180
SYMATTR InstName Q16
SYMATTR Value 2N3906
SYMBOL pnp 2592 4800 M180
SYMATTR InstName Q19
SYMATTR Value 2N3906
SYMBOL npn 2320 4336 R0
SYMATTR InstName Q20
SYMATTR Value 2N3904
SYMBOL npn 2448 4512 R0
SYMATTR InstName Q21
SYMATTR Value 2N3904
SYMBOL npn -768 6416 R0
SYMATTR InstName Q24
SYMATTR Value 2N3904
SYMBOL schottky -800 6384 R270
WINDOW 0 32 32 VTop 2
WINDOW 3 0 32 VBottom 2
SYMATTR InstName D6
SYMATTR Value BAT54
SYMATTR Description Diode
SYMATTR Type diode
SYMBOL res -720 6112 R0
SYMATTR InstName R25
SYMATTR Value {Rout_pull}
SYMBOL res -1488 5968 R270
WINDOW 0 32 56 VTop 2
WINDOW 3 0 56 VBottom 2
SYMATTR InstName R26
SYMATTR Value 1m
SYMBOL npn -1056 6192 R0
SYMATTR InstName Q26
SYMATTR Value 2N3904
SYMBOL res -1008 6304 R0
SYMATTR InstName R27
SYMATTR Value {Rin*2}
SYMBOL res -1008 6496 R0
SYMATTR InstName R28
SYMATTR Value {Rin}
SYMBOL npn -32 6416 R0
SYMATTR InstName Q27
SYMATTR Value 2N3904
SYMBOL schottky -64 6384 R270
WINDOW 0 32 32 VTop 2
WINDOW 3 0 32 VBottom 2
SYMATTR InstName D7
SYMATTR Value BAT54
SYMATTR Description Diode
SYMATTR Type diode
SYMBOL res 16 6112 R0
SYMATTR InstName R29
SYMATTR Value {Rout_pull}
SYMBOL npn -320 6192 R0
SYMATTR InstName Q28
SYMATTR Value 2N3904
SYMBOL res -272 6304 R0
SYMATTR InstName R30
SYMATTR Value {Rin}
SYMBOL res -272 6496 R0
SYMATTR InstName R31
SYMATTR Value {Rin}
SYMBOL cap -496 6224 R90
WINDOW 0 0 32 VBottom 2
WINDOW 3 32 32 VTop 2
SYMATTR InstName C1
SYMATTR Value 47p
SYMBOL schottky -432 6464 R180
WINDOW 0 24 64 Left 2
WINDOW 3 24 0 Left 2
SYMATTR InstName D8
SYMATTR Value BAT54
SYMATTR Description Diode
SYMATTR Type diode
SYMBOL res -400 6288 R0
SYMATTR InstName R32
SYMATTR Value 500
SYMBOL ind -400 6448 R0
SYMATTR InstName L1
SYMATTR Value 10µ
SYMBOL schottky 4672 5424 M270
WINDOW 0 32 32 VTop 2
WINDOW 3 0 32 VBottom 2
SYMATTR InstName D9
SYMATTR Value BAT54
SYMATTR Description Diode
SYMATTR Type diode
SYMBOL res 4688 5680 M180
WINDOW 0 36 76 Left 2
WINDOW 3 36 40 Left 2
SYMATTR InstName R33
SYMATTR Value {Rout_pull}
SYMBOL res 4384 5456 M180
WINDOW 0 36 76 Left 2
WINDOW 3 36 40 Left 2
SYMATTR InstName R34
SYMATTR Value {Rin*2}
SYMBOL res 4384 5280 M180
WINDOW 0 36 76 Left 2
WINDOW 3 36 40 Left 2
SYMATTR InstName R35
SYMATTR Value {Rin}
SYMBOL res 3664 5120 M90
WINDOW 0 0 56 VBottom 2
WINDOW 3 32 56 VTop 2
SYMATTR InstName R36
SYMATTR Value 1m
SYMBOL res 3936 5760 M180
WINDOW 0 36 76 Left 2
WINDOW 3 36 40 Left 2
SYMATTR InstName R39
SYMATTR Value {Rc_up}
SYMBOL pnp 4640 5360 M180
SYMATTR InstName Q29
SYMATTR Value 2N3906
SYMBOL pnp 4336 5616 M180
SYMATTR InstName Q30
SYMATTR Value 2N3906
SYMBOL pnp 4160 5696 M180
SYMATTR InstName Q31
SYMATTR Value 2N3906
SYMBOL npn 3888 5232 R0
SYMATTR InstName Q32
SYMATTR Value 2N3904
SYMBOL npn 4016 5392 R0
SYMATTR InstName Q33
SYMATTR Value 2N3904
SYMBOL schottky 4672 4528 M270
WINDOW 0 32 32 VTop 2
WINDOW 3 0 32 VBottom 2
SYMATTR InstName D11
SYMATTR Value BAT54
SYMATTR Description Diode
SYMATTR Type diode
SYMBOL res 4688 4784 M180
WINDOW 0 36 76 Left 2
WINDOW 3 36 40 Left 2
SYMATTR InstName R41
SYMATTR Value {Rout_pull}
SYMBOL res 4384 4560 M180
WINDOW 0 36 76 Left 2
WINDOW 3 36 40 Left 2
SYMATTR InstName R42
SYMATTR Value {Rin*2}
SYMBOL res 4384 4384 M180
WINDOW 0 36 76 Left 2
WINDOW 3 36 40 Left 2
SYMATTR InstName R43
SYMATTR Value {Rin}
SYMBOL res 3664 4224 M90
WINDOW 0 0 56 VBottom 2
WINDOW 3 32 56 VTop 2
SYMATTR InstName R44
SYMATTR Value 1m
SYMBOL res 3936 4864 M180
WINDOW 0 36 76 Left 2
WINDOW 3 36 40 Left 2
SYMATTR InstName R45
SYMATTR Value {Rc_up}
SYMBOL pnp 4640 4464 M180
SYMATTR InstName Q34
SYMATTR Value 2N3906
SYMBOL pnp 4336 4720 M180
SYMATTR InstName Q35
SYMATTR Value 2N3906
SYMBOL pnp 4160 4800 M180
SYMATTR InstName Q36
SYMATTR Value 2N3906
SYMBOL npn 3888 4336 R0
SYMATTR InstName Q37
SYMATTR Value 2N3904
SYMBOL npn 4016 4512 R0
SYMATTR InstName Q38
SYMATTR Value 2N3904
SYMBOL res 3728 4544 R90
WINDOW 0 0 56 VBottom 2
WINDOW 3 32 56 VTop 2
SYMATTR InstName R46
SYMATTR Value 1k
SYMBOL res 3744 5424 R90
WINDOW 0 0 56 VBottom 2
WINDOW 3 32 56 VTop 2
SYMATTR InstName R47
SYMATTR Value 1k
SYMBOL cap 3792 5552 R0
SYMATTR InstName C2
SYMATTR Value 22p
SYMBOL cap 3792 4656 R0
SYMATTR InstName C3
SYMATTR Value 22p
SYMBOL voltage -832 6800 R0
SYMATTR InstName V1
SYMATTR Value 2.5
SYMBOL res -608 7056 R90
WINDOW 0 0 56 VBottom 2
WINDOW 3 32 56 VTop 2
SYMATTR InstName R48
SYMATTR Value 10
SYMBOL npn -32 6800 R0
SYMATTR InstName Q39
SYMATTR Value 2N3904
SYMBOL schottky -64 6944 R270
WINDOW 0 32 32 VTop 2
WINDOW 3 0 32 VBottom 2
SYMATTR InstName D12
SYMATTR Value BAT54
SYMATTR Description Diode
SYMATTR Type diode
SYMBOL npn 432 6416 R0
SYMATTR InstName Q40
SYMATTR Value 2N3904
SYMBOL schottky 400 6384 R270
WINDOW 0 32 32 VTop 2
WINDOW 3 0 32 VBottom 2
SYMATTR InstName D13
SYMATTR Value BAT54
SYMATTR Description Diode
SYMATTR Type diode
SYMBOL res 480 6112 R0
SYMATTR InstName R49
SYMATTR Value {Rout_pull}
SYMBOL npn 144 6192 R0
SYMATTR InstName Q41
SYMATTR Value 2N3904
SYMBOL res 192 6304 R0
SYMATTR InstName R50
SYMATTR Value {Rin}
SYMBOL res 192 6496 R0
SYMATTR InstName R51
SYMATTR Value {Rin}
SYMBOL res -4448 6368 R270
WINDOW 0 32 56 VTop 2
WINDOW 3 0 56 VBottom 2
SYMATTR InstName R52
SYMATTR Value 1m
SYMBOL npn -4176 6304 R0
SYMATTR InstName Q42
SYMATTR Value 2N3904
SYMBOL schottky -4208 6272 R270
WINDOW 0 32 32 VTop 2
WINDOW 3 0 32 VBottom 2
SYMATTR InstName D14
SYMATTR Value BAT54
SYMATTR Description Diode
SYMATTR Type diode
SYMBOL res -5184 5392 R270
WINDOW 0 32 56 VTop 2
WINDOW 3 0 56 VBottom 2
SYMATTR InstName R53
SYMATTR Value 1m
SYMBOL npn -4688 5808 R0
SYMATTR InstName Q43
SYMATTR Value 2N3904
SYMBOL res -4640 5568 R0
SYMATTR InstName R55
SYMATTR Value 1m
SYMBOL res -4128 6416 R0
SYMATTR InstName R56
SYMATTR Value 1m
SYMBOL res -4640 6208 R0
SYMATTR InstName R57
SYMATTR Value {Rin}
SYMBOL res -4640 6592 R0
SYMATTR InstName R58
SYMATTR Value {Rin}
SYMBOL voltage -5056 6896 R0
SYMATTR InstName V2
SYMATTR Value 2.5
SYMBOL res -4096 7360 R180
WINDOW 0 36 76 Left 2
WINDOW 3 36 40 Left 2
SYMATTR InstName R59
SYMATTR Value 1
SYMBOL npn -4256 6896 R0
SYMATTR InstName Q44
SYMATTR Value 2N3904
SYMBOL voltage -5056 5104 M0
SYMATTR InstName V3
SYMATTR Value 2.5
SYMBOL res -4496 5040 M270
WINDOW 0 32 56 VTop 2
WINDOW 3 0 56 VBottom 2
SYMATTR InstName R60
SYMATTR Value 10
SYMBOL pnp -4256 5216 M180
SYMATTR InstName Q45
SYMATTR Value 2N3906
SYMBOL res -4448 5744 M90
WINDOW 0 0 56 VBottom 2
WINDOW 3 32 56 VTop 2
SYMATTR InstName R61
SYMATTR Value 1m
SYMBOL schottky -4144 5840 R90
WINDOW 0 0 32 VBottom 2
WINDOW 3 32 32 VTop 2
SYMATTR InstName D15
SYMATTR Value BAT54
SYMATTR Description Diode
SYMATTR Type diode
SYMBOL res -4816 6544 M180
WINDOW 0 36 76 Left 2
WINDOW 3 36 40 Left 2
SYMATTR InstName R62
SYMATTR Value 1m
SYMBOL res -4128 5696 M180
WINDOW 0 36 76 Left 2
WINDOW 3 36 40 Left 2
SYMATTR InstName R63
SYMATTR Value 1m
SYMBOL res -4816 6032 M180
WINDOW 0 36 76 Left 2
WINDOW 3 36 40 Left 2
SYMATTR InstName R64
SYMATTR Value {Rin}
SYMBOL res -4816 5520 M180
WINDOW 0 36 76 Left 2
WINDOW 3 36 40 Left 2
SYMATTR InstName R65
SYMATTR Value {Rin}
SYMBOL pnp -4176 5808 M180
SYMATTR InstName Q46
SYMATTR Value 2N3906
SYMBOL pnp -4864 6192 M180
SYMATTR InstName Q47
SYMATTR Value 2N3906
SYMBOL npn -5664 6256 R0
SYMATTR InstName Q48
SYMATTR Value 2N3904
SYMBOL schottky -5696 6224 R270
WINDOW 0 32 32 VTop 2
WINDOW 3 0 32 VBottom 2
SYMATTR InstName D16
SYMATTR Value BAT54
SYMATTR Description Diode
SYMATTR Type diode
SYMBOL res -5616 5952 R0
SYMATTR InstName R66
SYMATTR Value {Rout_pull}
SYMBOL res -6384 5808 R270
WINDOW 0 32 56 VTop 2
WINDOW 3 0 56 VBottom 2
SYMATTR InstName R67
SYMATTR Value 1m
SYMBOL npn -5952 6032 R0
SYMATTR InstName Q49
SYMATTR Value 2N3904
SYMBOL res -5904 6144 R0
SYMATTR InstName R68
SYMATTR Value {Rin*2}
SYMBOL res -5904 6336 R0
SYMATTR InstName R69
SYMATTR Value {Rin}
SYMBOL cap -5392 6064 R90
WINDOW 0 0 32 VBottom 2
WINDOW 3 32 32 VTop 2
SYMATTR InstName C5
SYMATTR Value 10p
SYMBOL schottky -5328 6304 R180
WINDOW 0 24 64 Left 2
WINDOW 3 24 0 Left 2
SYMATTR InstName D17
SYMATTR Value BAT54
SYMATTR Description Diode
SYMATTR Type diode
SYMBOL res -5296 6128 R0
SYMATTR InstName R70
SYMATTR Value 500
SYMBOL ind -5296 6288 R0
SYMATTR InstName L2
SYMATTR Value 1µ
SYMBOL cap -3856 6000 R90
WINDOW 0 0 32 VBottom 2
WINDOW 3 32 32 VTop 2
SYMATTR InstName C4
SYMATTR Value 220p
SYMBOL schottky -3792 6240 R180
WINDOW 0 24 64 Left 2
WINDOW 3 24 0 Left 2
SYMATTR InstName D18
SYMATTR Value BAT54
SYMATTR Description Diode
SYMATTR Type diode
SYMBOL res -3760 6064 R0
SYMATTR InstName R71
SYMATTR Value 35
SYMBOL res -2832 6368 R270
WINDOW 0 32 56 VTop 2
WINDOW 3 0 56 VBottom 2
SYMATTR InstName R72
SYMATTR Value 1m
SYMBOL npn -2560 6304 R0
SYMATTR InstName Q51
SYMATTR Value 2N3904
SYMBOL schottky -2592 6272 R270
WINDOW 0 32 32 VTop 2
WINDOW 3 0 32 VBottom 2
SYMATTR InstName D19
SYMATTR Value BAT54
SYMATTR Description Diode
SYMATTR Type diode
SYMBOL npn -3072 5808 R0
SYMATTR InstName Q52
SYMATTR Value 2N3904
SYMBOL res -3024 5568 R0
SYMATTR InstName R73
SYMATTR Value 1m
SYMBOL res -2512 6416 R0
SYMATTR InstName R74
SYMATTR Value 1m
SYMBOL res -3024 6208 R0
SYMATTR InstName R75
SYMATTR Value {Rin}
SYMBOL res -3024 6592 R0
SYMATTR InstName R76
SYMATTR Value {Rin}
SYMBOL res -2832 5744 M90
WINDOW 0 0 56 VBottom 2
WINDOW 3 32 56 VTop 2
SYMATTR InstName R79
SYMATTR Value 1m
SYMBOL schottky -2528 5840 R90
WINDOW 0 0 32 VBottom 2
WINDOW 3 32 32 VTop 2
SYMATTR InstName D20
SYMATTR Value BAT54
SYMATTR Description Diode
SYMATTR Type diode
SYMBOL res -3200 6544 M180
WINDOW 0 36 76 Left 2
WINDOW 3 36 40 Left 2
SYMATTR InstName R80
SYMATTR Value 1m
SYMBOL res -2512 5696 M180
WINDOW 0 36 76 Left 2
WINDOW 3 36 40 Left 2
SYMATTR InstName R81
SYMATTR Value 1m
SYMBOL res -3200 6032 M180
WINDOW 0 36 76 Left 2
WINDOW 3 36 40 Left 2
SYMATTR InstName R82
SYMATTR Value {Rin}
SYMBOL res -3200 5520 M180
WINDOW 0 36 76 Left 2
WINDOW 3 36 40 Left 2
SYMATTR InstName R83
SYMATTR Value {Rin}
SYMBOL pnp -2560 5808 M180
SYMATTR InstName Q55
SYMATTR Value 2N3906
SYMBOL pnp -3248 6192 M180
SYMATTR InstName Q56
SYMATTR Value 2N3906
SYMBOL res -3392 6128 R90
WINDOW 0 0 56 VBottom 2
WINDOW 3 32 56 VTop 2
SYMATTR InstName R77
SYMATTR Value 1
SYMBOL npn -2720 6896 R0
SYMATTR InstName Q53
SYMATTR Value 2N3904
SYMBOL res -2480 7344 R180
WINDOW 0 36 76 Left 2
WINDOW 3 36 40 Left 2
SYMATTR InstName R54
SYMATTR Value 1
TEXT -1480 4040 Left 2 !.tran {32*reps/freq}
TEXT -1480 3768 Left 2 !.param VCC=5
TEXT -1480 3800 Left 2 !.param freq=20mega
TEXT -1480 3832 Left 2 !.param rise=1n
TEXT -1480 3864 Left 2 !.param reps=1
TEXT 512 4016 Left 2 ;PAR_LD
TEXT 528 3992 Left 2 ;PAR_D
TEXT 536 3888 Left 2 ;SHIFT
TEXT -1480 3928 Left 2 !.param Rin=100
TEXT -1480 3960 Left 2 !.param Rout_pull=300
TEXT -1480 3992 Left 2 !.param Rin_ld = 1000
TEXT -1480 3896 Left 2 !.param Rc_up=1000
TEXT -1480 4080 Left 2 !.step temp -25 125 25
TEXT -1480 4112 Left 2 !.temp 125
TEXT -776 5912 Left 2 ;This is a temperature-compensated edge-generator
TEXT 56 6928 Left 2 ;Very high current (200mA) through this diode!!!!

The netlist it stands for:
* d_flop.asc
VCC VCC 0 {VCC}
V_BIT5 DATA 0 PULSE(0 {VCC} 0 {rise} {rise} {1/freq/1.5-rise} {1/freq/0.75} {256*reps}) AC 5
A1 0 N001 N002 N005 0 N006 0 0 AND
A2 0 N006 N010 N011 0 N005 0 0 AND
A3 0 0 N004 N007 0 0 N001 0 OR
A4 0 N008 N009 0 0 0 N002 0 OR
A5 0 N003 N007 0 0 0 N010 0 OR
A6 0 N012 N009 0 0 0 N011 0 OR
A7 N012 0 0 0 0 N008 0 0 BUF
Q190 EN N027 0 0 2N3904
D61 N027 EN BAT54
R428 N013 EN {Rout_pull}
R430 VCC N013 1m
Q191 N013 CLK N022 0 2N3904
R433 N022 N027 {Rin*2}
R434 N027 0 {Rin}
Q192 _EN N028 0 0 2N3904
D62 N028 _EN BAT54
R427 N013 _EN {Rout_pull}
Q193 N013 EN N023 0 2N3904
R429 N023 N028 {Rin*2}
R431 N028 0 {Rin}
Q1 _D0 N026 0 0 2N3904
D10 N026 _D0 BAT54
R3 VCC N014 1m
Q2 N014 D0 N020 0 2N3904
R37 N014 _D0 {Rout_pull}
R38 N020 N026 {Rin*2}
R40 N026 0 {Rin}
Q3 D0 N045 0 0 2N3904
D1 N045 D0 BAT54
Q4 N034 _D0 N041 0 2N3904
R4 N034 D0 {Rout_pull}
R5 N041 N045 {Rin*2}
R6 N045 0 {Rin}
Q5 N014 N017 N020 0 2N3904
Q6 0 D N017 0 2N3906
Q7 0 DCLK N017 0 2N3906
R2 VCC N034 1m
Q8 N034 N038 N041 0 2N3904
Q9 0 _D N038 0 2N3906
Q10 0 DCLK N038 0 2N3906
R7 N034 N038 {Rc_up}
R8 N014 N017 {Rc_up}
Q11 _D N048 0 0 2N3904
D2 N048 _D BAT54
R9 N033 _D {Rout_pull}
R10 VCC N033 1m
Q12 N033 DATA N043 0 2N3904
R13 N043 N048 {Rin*2}
R14 N048 0 {Rin}
Q13 D N049 0 0 2N3904
D3 N049 D BAT54
R15 N033 D {Rout_pull}
Q14 N033 _D N044 0 2N3904
R16 N044 N049 {Rin*2}
R17 N049 0 {Rin}
V_BIT1 CLK 0 PULSE(0 {VCC} {1/freq/4} {rise} {rise} {1/freq/2-rise} {1/freq} {128*reps}) AC 5
D5 D1 N039 BAT54
R19 0 D1 {Rout_pull}
R20 N046 N039 {Rin*2}
R21 N039 N035 {Rin}
R22 VCC N035 1m
R23 0 N050 {Rc_up}
Q25 D1 N039 N035 0 2N3906
Q17 0 _D1 N046 0 2N3906
Q18 0 N050 N046 0 2N3906
Q22 N035 DCLK N050 0 2N3904
Q23 N035 _D N050 0 2N3904
D4 _D1 N018 BAT54
R1 0 _D1 {Rout_pull}
R11 N024 N018 {Rin*2}
R12 N018 N015 {Rin}
R18 VCC N015 1m
R24 0 N029 {Rc_up}
Q15 _D1 N018 N015 0 2N3906
Q16 0 D1 N024 0 2N3906
Q19 0 N029 N024 0 2N3906
Q20 N015 DCLK N029 0 2N3904
Q21 N015 D N029 0 2N3904
Q24 _CLK N079 0 0 2N3904
D6 N079 _CLK BAT54
R25 N062 _CLK {Rout_pull}
R26 VCC N062 1m
Q26 N062 CLK N074 0 2N3904
R27 N074 N079 {Rin*2}
R28 N079 0 {Rin}
Q27 _DCLK N080 N087 0 2N3904
D7 N080 _DCLK BAT54
R29 N062 _DCLK {Rout_pull}
Q28 N062 N070 N075 0 2N3904
R30 N075 N080 {Rin}
R31 N080 N088 {Rin}
C1 N070 _CLK 47p
D8 0 N070 BAT54
R32 N070 N086 500
L1 N086 0 10µ
D9 D2 N040 BAT54
R33 0 D2 {Rout_pull}
R34 N047 N040 {Rin*2}
R35 N040 N036 {Rin}
R36 VCC N036 1m
R39 0 N051 {Rc_up}
Q29 D2 N040 N036 0 2N3906
Q30 0 _D2 N047 0 2N3906
Q31 0 N051 N047 0 2N3906
Q32 N036 DCLK N051 0 2N3904
Q33 N036 N042 N051 0 2N3904
D11 _D2 N019 BAT54
R41 0 _D2 {Rout_pull}
R42 N025 N019 {Rin*2}
R43 N019 N016 {Rin}
R44 VCC N016 1m
R45 0 N030 {Rc_up}
Q34 _D2 N019 N016 0 2N3906
Q35 0 D2 N025 0 2N3906
Q36 0 N030 N025 0 2N3906
Q37 N016 DCLK N030 0 2N3904
Q38 N016 N021 N030 0 2N3904
R46 N021 D1 1k
R47 N042 _D1 1k
C2 N042 0 22p
C3 N021 0 22p
V1 0 N089 2.5
R48 N088 N089 10
Q39 N087 0 N088 0 2N3904
D12 0 N088 BAT54
Q40 DCLK N081 0 0 2N3904
D13 N081 DCLK BAT54
R49 N062 DCLK {Rout_pull}
Q41 N062 _DCLK N076 0 2N3904
R50 N076 N081 {Rin}
R51 N081 0 {Rin}
R52 N077 N071 1m
Q42 inv_int N071 N082 0 2N3904
D14 N071 inv_int BAT54
R53 VCC N037 1m
Q43 N059 _CLK N068 0 2N3904
R55 N037 N059 1m
R56 N082 N090 1m
R57 N068 N077 {Rin}
R58 N077 N092 {Rin}
V2 0 N092 2.5
R59 N092 N090 1
Q44 0 0 N090 0 2N3904
V3 N031 N037 2.5
R60 N032 N031 10
Q45 N037 N037 N032 0 2N3906
R61 N054 N055 1m
D15 inv_int N055 BAT54
R62 0 N084 1m
R63 N052 N032 1m
R64 N064 N054 {Rin}
R65 N054 N031 {Rin}
Q46 inv_int N055 N052 0 2N3906
Q47 N084 _CLK N064 0 2N3906
Q48 _CLK N067 0 0 2N3904
D16 N067 _CLK BAT54
R66 N058 _CLK {Rout_pull}
R67 VCC N058 1m
Q49 N058 CLK N066 0 2N3904
R68 N066 N067 {Rin*2}
R69 N067 0 {Rin}
C5 N063 _CLK 10p
D17 0 N063 BAT54
R70 N063 N073 500
L2 N073 0 1µ
C4 inv_ac inv_int 220p
D18 0 inv_ac BAT54
R71 inv_ac 0 35
R72 N078 N072 1m
Q51 inv_final N072 N083 0 2N3904
D19 N072 inv_final BAT54
Q52 N060 N061 N069 0 2N3904
R73 N037 N060 1m
R74 N083 N091 1m
R75 N069 N078 {Rin}
R76 N078 N092 {Rin}
R79 N056 N057 1m
D20 inv_final N057 BAT54
R80 0 N085 1m
R81 N053 N032 1m
R82 N065 N056 {Rin}
R83 N056 N031 {Rin}
Q55 inv_final N057 N053 0 2N3906
Q56 N085 N061 N065 0 2N3906
R77 N061 inv_ac 1
Q53 0 0 N091 0 2N3904
R54 N092 N091 1
.model D D
.lib standard.dio
.model NPN NPN
.model PNP PNP
.lib standard.bjt
.tran {32*reps/freq}
.param VCC=5
.param freq=20mega
.param rise=1n
.param reps=1
* PAR_LD
* PAR_D
* SHIFT
.param Rin=100
.param Rout_pull=300
.param Rin_ld = 1000
.param Rc_up=1000
.step temp -25 125 25
.temp 125
* This is a temperature-compensated edge-generator
* Very high current (200mA) through this diode!!!!
.backanno
.end